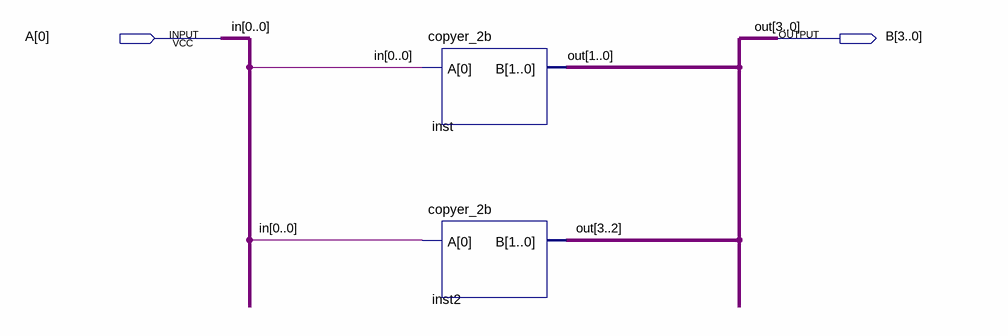
[diagram p0: schematic sheet]
// Quartus schematic copyer_4b.bdf as structural Verilog: 2 symbols, 2 pins
module copyer_4b (
  input  [0:0] A,
  output [3:0] B
);

  copyer_2b inst (.A(A[0]), .B(B[1:0]));
  copyer_2b inst2 (.A(A[0]), .B(B[3:2]));

  // Other names for the same wires on the sheet: in[0] = A[0]; out[3:0] = B
endmodule
